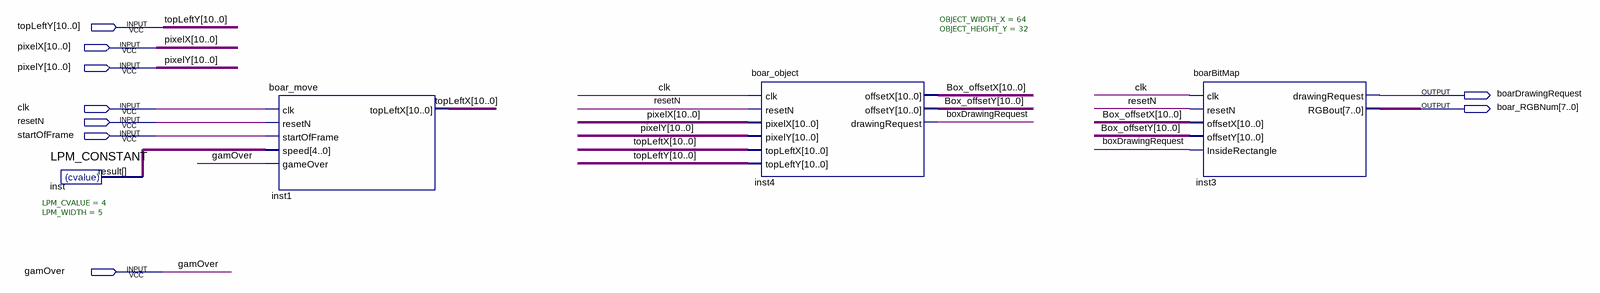
[diagram p0: schematic sheet]
// Quartus schematic Boar_Block.bdf as structural Verilog: 4 symbols, 9 pins
module Boar_Block (
  input  [10:0] topLeftY,
  input  [10:0] pixelX,
  input  [10:0] pixelY,
  input  clk,
  input  resetN,
  input  startOfFrame,
  input  gamOver,
  output boarDrawingRequest,
  output [7:0] boar_RGBNum
);

  wire boxDrawingRequest;
  wire [4:0] inst_result;
  wire [10:0] Box_offsetX, Box_offsetY, topLeftX;

  LPM_CONSTANT #(.LPM_CVALUE(4), .LPM_WIDTH(5)) inst (.result(inst_result));
  boar_move inst1 (
    .clk(clk), .resetN(resetN), .startOfFrame(startOfFrame), .speed(inst_result), .gameOver(gamOver),
    .topLeftX(topLeftX));
  boar_object #(.OBJECT_WIDTH_X(64), .OBJECT_HEIGHT_Y(32)) inst4 (
    .clk(clk), .resetN(resetN), .pixelX(pixelX), .pixelY(pixelY), .topLeftX(topLeftX), .topLeftY(topLeftY),
    .offsetX(Box_offsetX), .offsetY(Box_offsetY), .drawingRequest(boxDrawingRequest));
  boarBitMap inst3 (
    .clk(clk), .resetN(resetN), .offsetX(Box_offsetX), .offsetY(Box_offsetY),
    .InsideRectangle(boxDrawingRequest), .drawingRequest(boarDrawingRequest), .RGBout(boar_RGBNum));
endmodule
